# EasyEDA schematic schematic designe.json
TITLE: Capacitor Dropper power Supply; REV: 1.0; Date: 2024-09-26; Sheet: 1/1; Drawn By: jitendra sharma
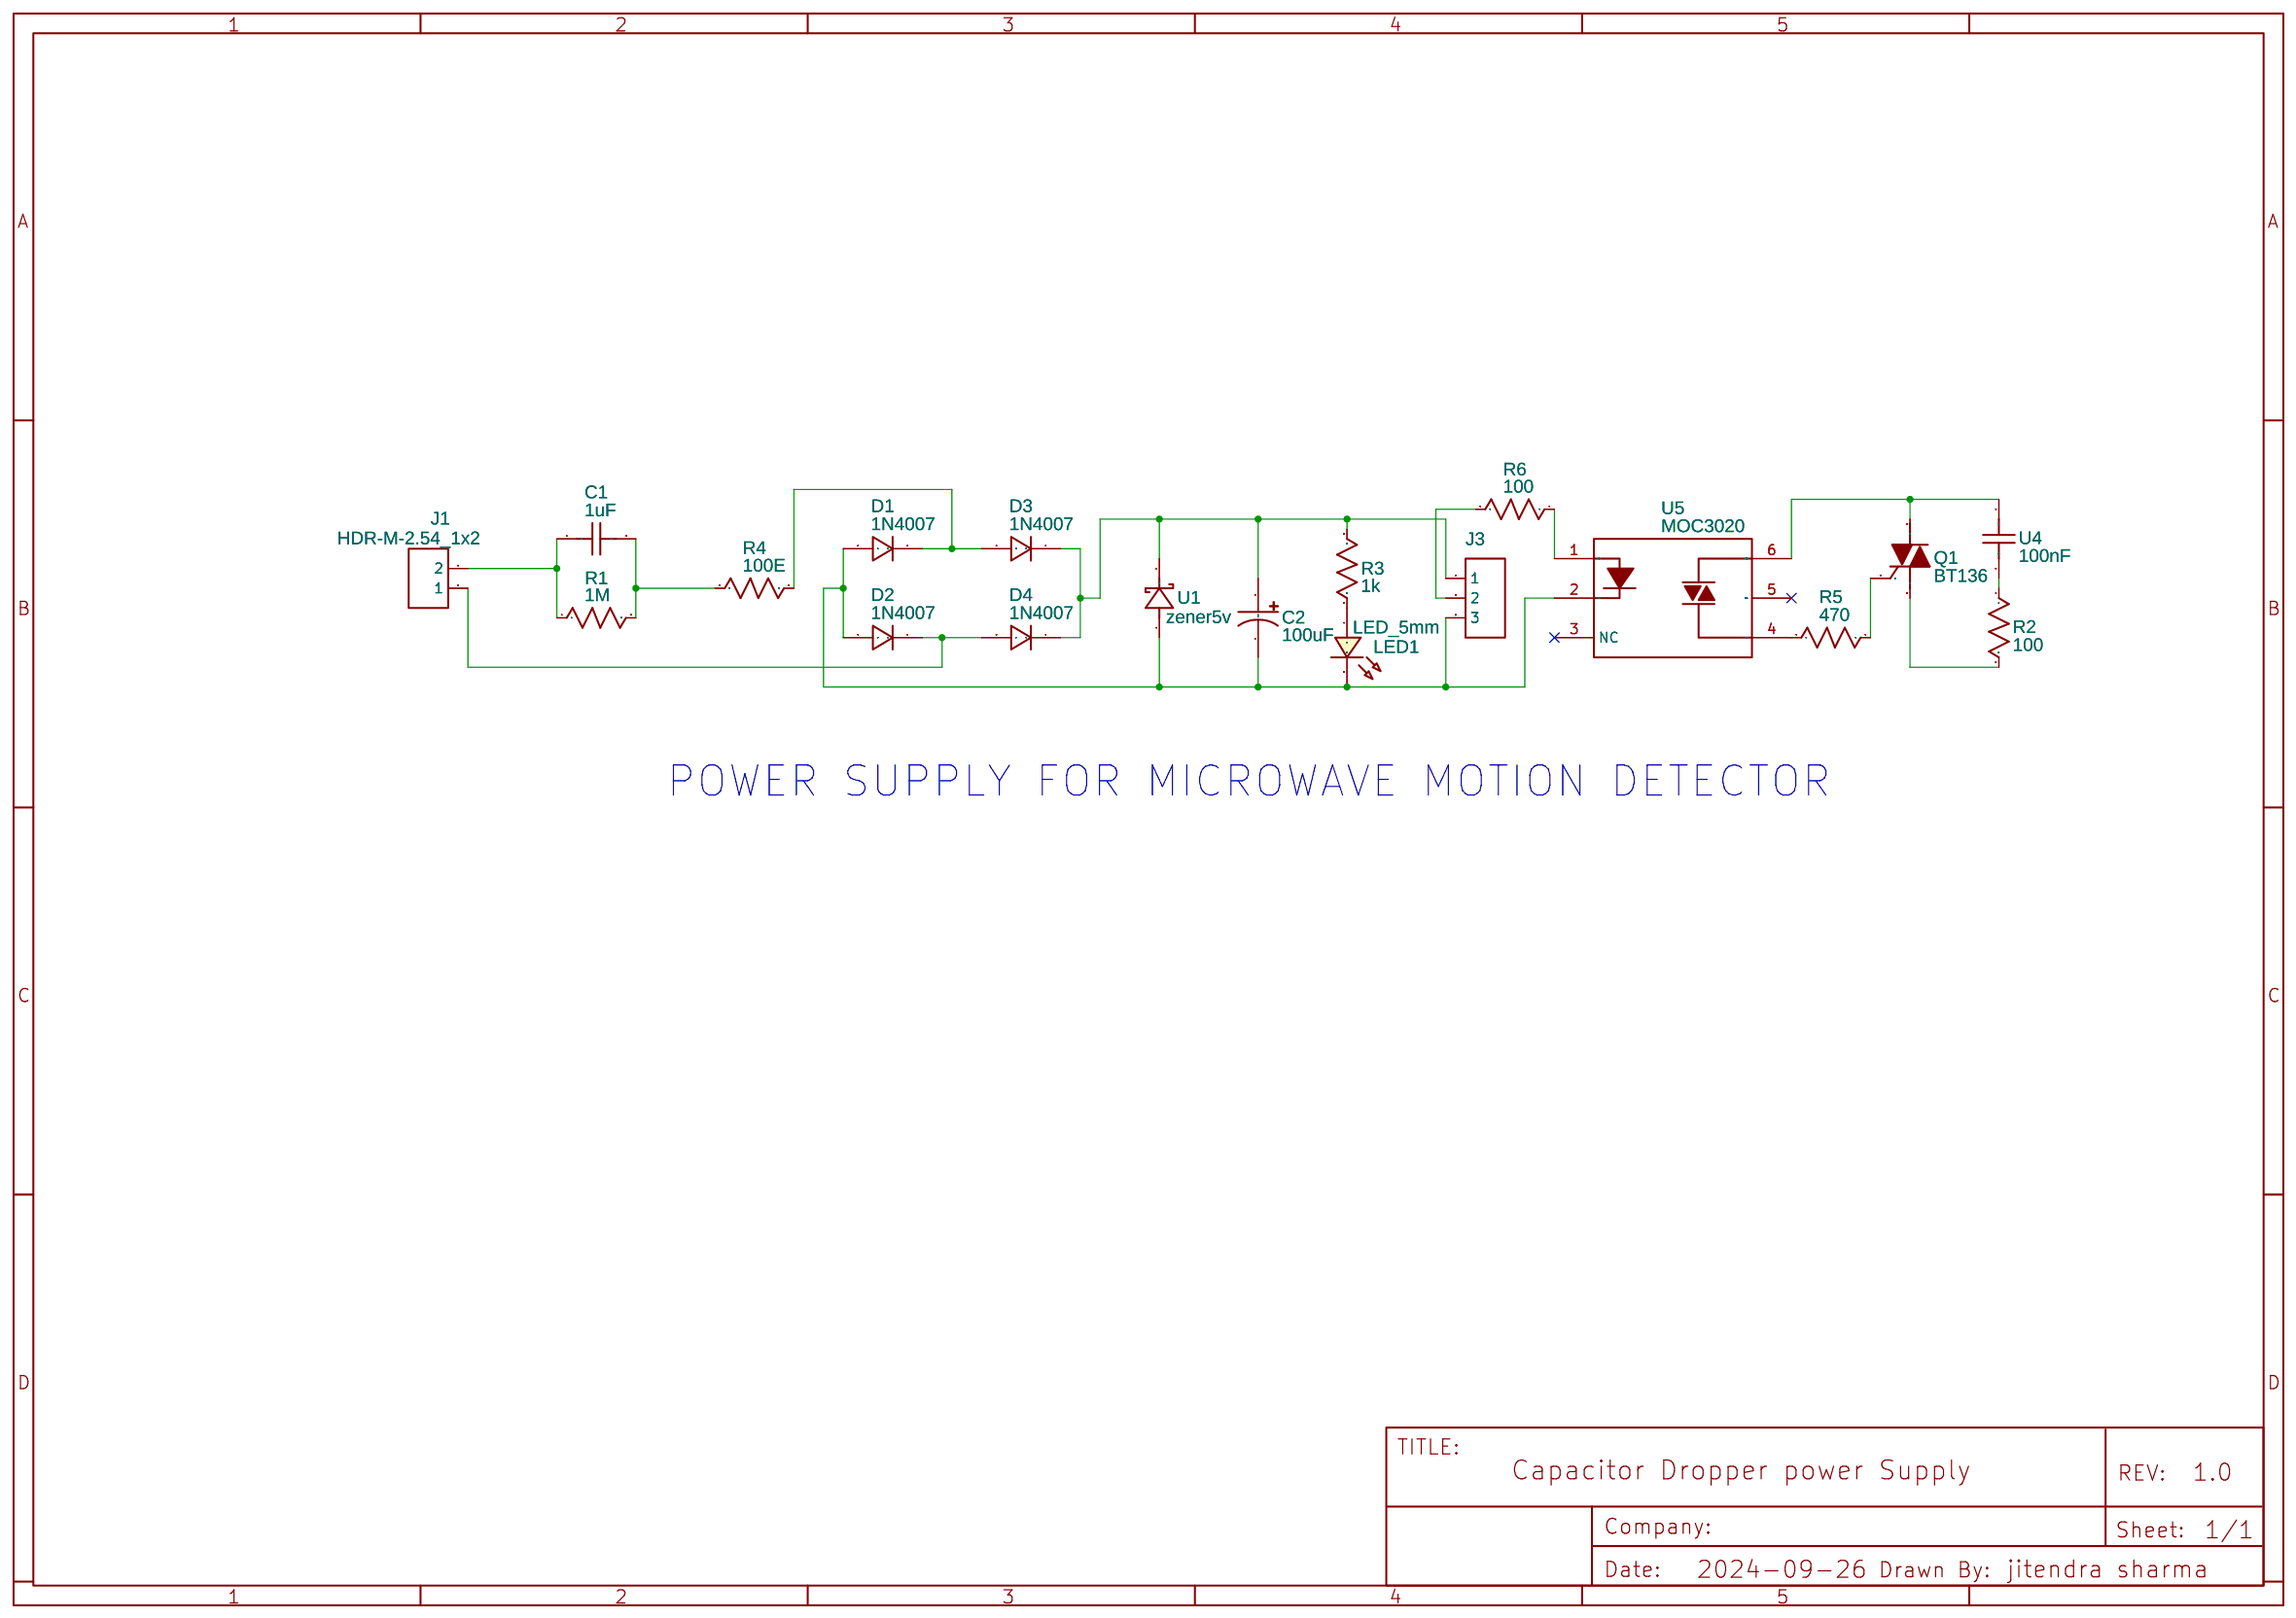
[diagram p0: schematic sheet]

## Parts
C1  1uF  [CAP-TH_L17.5-W5.0-P15.00-D0.6]
C2  100uF  [CAP-TH_BD6.3-P2.50-D0.6-FD-1]
D1  1N4007  [DO-41_BD2.4-L4.7-P8.70-D0.9-RD]
D2  1N4007  [DO-41_BD2.4-L4.7-P8.70-D0.9-RD]
D3  1N4007  [DO-41_BD2.4-L4.7-P8.70-D0.9-RD]
D4  1N4007  [DO-41_BD2.4-L4.7-P8.70-D0.9-RD]
J1  HDR-M-2.54_1x2  [HDR-M-2.54_1X2]
J3  HDR-M-2.54_1x3  [HDR-M-2.54_1X3]
LED1  LED_5mm  [LED-TH_BD5.0_RED]
Q1  BT136  [TO-220-3_L10.0-W4.5-P2.54-T]
R1  1M  [R_AXIAL-0.4]
R2  100  [R_AXIAL-0.3]
R3  1k  [R_AXIAL-0.4]
R4  100E  [R_AXIAL-0.5]
R5  470  [R_AXIAL-0.3]
R6  100  [R_AXIAL-0.3]
U1  zener5v  [DO-41_BD2.4-L4.7-P8.70-D0.8-FD]
U4  100nF  [CAP-TH_L7.2-W2.5-P5.00-D0.6]
U5  MOC3020  [DIP-6_L7.1-W6.5-P2.54-LS7.6-BL]

## Library data of the parts
C1 = BFC237321105: Supplier: LCSC; Supplier Part: C3000888; Manufacturer: VISHAY(威世); JLCPCB Part Class: Extended Part; Contributor: lcsc
C2 = KNE2100UF25V149EC0011: Contributor: lcsc; Supplier: LCSC; Supplier Part: C2927892; Manufacturer: KNSCHA(科尼盛); JLCPCB Part Class: Extended Part
D1-D4 = 1N4007: Supplier: LCSC; Manufacturer: SEMTECH; Supplier Part: C106903; Contributor: LCEDA_Lib
J1 = HDR-M-2.54_1x2: Supplier Part: C124375; Supplier: LCSC; Contributor: LCEDA_Lib
J3 = HDR-M-2.54_1x3: Supplier Part: C180248; Supplier: LCSC; Contributor: LCEDA_Lib
LED1 = LED-TH-5mm_R: Manufacturer: EVERLIGHT(台湾亿光); Manufacturer Part: 333-2SURD/S530-A3; Supplier Part: C87271; Supplier: LCSC; Contributor: LCEDA_Lib
Q1 = BT136: Supplier: LCSC; Manufacturer: CJ(江苏长电/长晶); Supplier Part: C98796; JLCPCB Part Class: Extended Part
R1 R3 = R_AXIAL-0.4_US: Contributor: LCEDA_Lib
R2 R5 R6 = R_AXIAL-0.3_US: Contributor: LCEDA_Lib
R4 = R_AXIAL-0.5_US: Contributor: LCEDA_Lib
U1 = 1N4007-DIODE: Contributor: LCSC; Supplier: LCSC; Supplier Part: C9900005663; Manufacturer: null
U4 = MEB104J100V82CB0018: Supplier: LCSC; Supplier Part: C3034534; Manufacturer: KNSCHA(科尼盛); JLCPCB Part Class: Extended Part; Contributor: lcsc
U5 = MOC3020: Contributor: LCSC; Supplier: LCSC; Manufacturer: LITEON(光宝); Supplier Part: C115463

## Nets
Net-(C1-1): C1.1 J1.2 R1.1
Net-(C1-2): C1.2 R1.2 R4.1
Net-(C2-1): C2.1 D3.1 D4.1 J3.1 R3.1 U1.2(K)
Net-(C2-2): C2.2 D1.2 D2.2 J3.3 LED1.2 U1.1(A) U5.2(Cathode )
Net-(D1-1): D1.1 D3.2 R4.2
Net-(D2-1): D2.1 D4.2 J1.1
Net-(J3-2): J3.2 R6.2
Net-(LED1-1): LED1.1 R3.2
Net-(Q1-1): Q1.1(M1) R2.2
Net-(Q1-2): Q1.2(M2) U4.1 U5.6(Terminal )
Net-(Q1-3): Q1.3(G) R5.2
Net-(R2-1): R2.1 U4.2
Net-(R5-1): R5.1 U5.4( Terminal)
Net-(R6-1): R6.1 U5.1(ANODE)

Not connected (* = marked no-connect by the designer): U5 3(NC)* 5(Substrate )*

## Notes on the sheet
- POWER SUPPLY FOR MICROWAVE MOTION DETECTOR
